# Altium schematic sheet DSUB.schdoc
size 298 x 162 mm
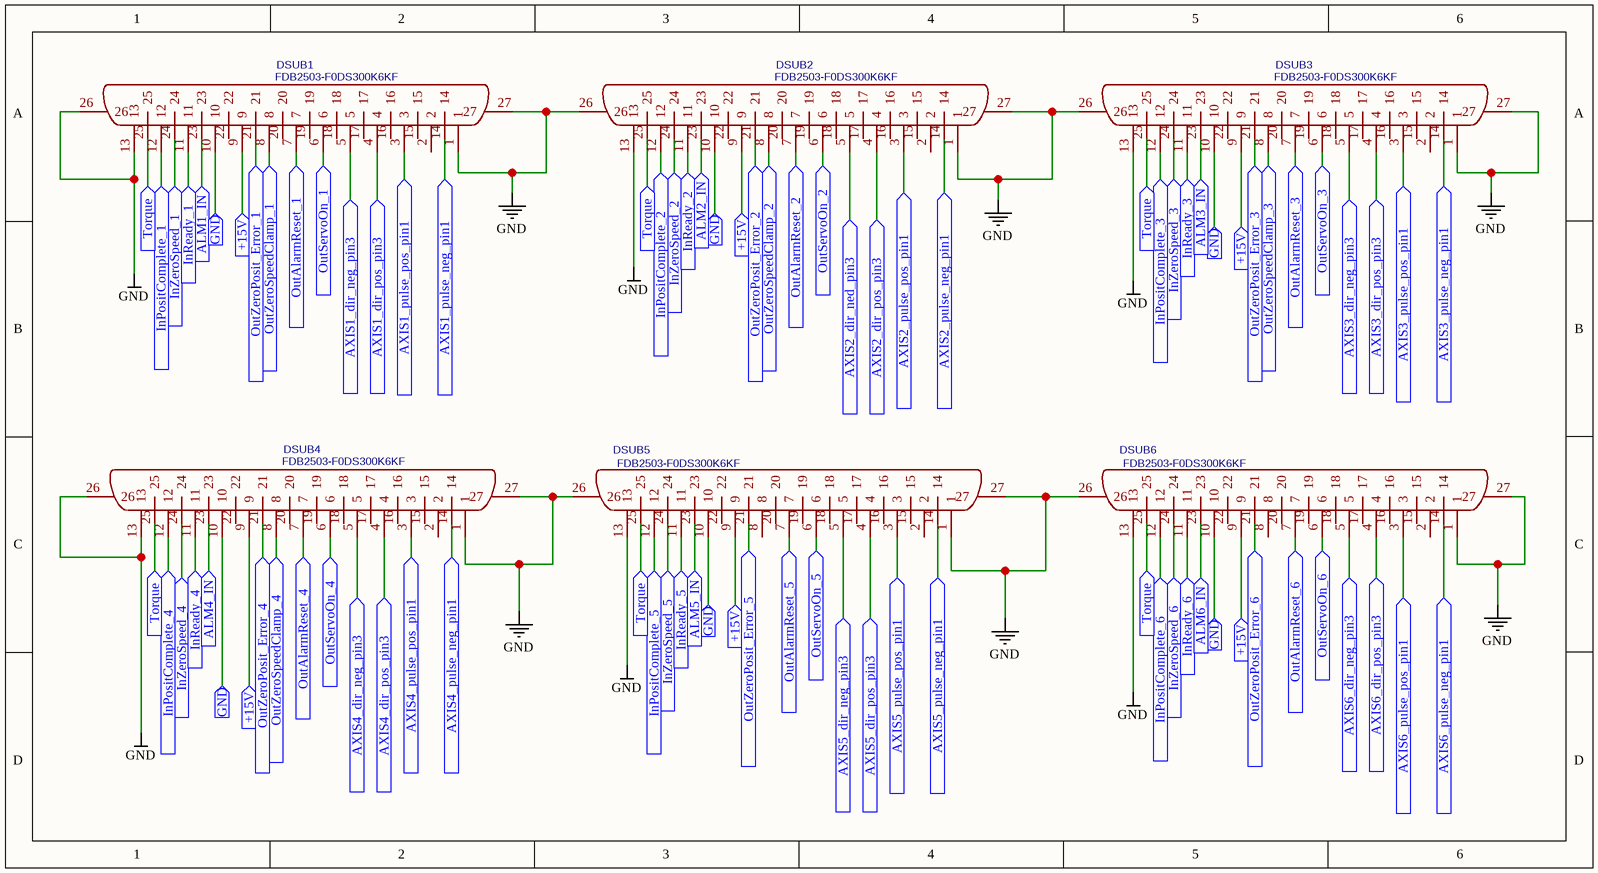
[diagram p0: DSUB.schdoc]

## Parts
DSUB1  FDB2503-F0DS300K6KF  [DB25-TH_FDB2503-F0DS300K6KF]
DSUB2  FDB2503-F0DS300K6KF  [DB25-TH_FDB2503-F0DS300K6KF]
DSUB3  FDB2503-F0DS300K6KF  [DB25-TH_FDB2503-F0DS300K6KF]
DSUB4  FDB2503-F0DS300K6KF  [DB25-TH_FDB2503-F0DS300K6KF]
DSUB5  FDB2503-F0DS300K6KF  [DB25-TH_FDB2503-F0DS300K6KF]
DSUB6  FDB2503-F0DS300K6KF  [DB25-TH_FDB2503-F0DS300K6KF]

## Ports
+15V (in), ALM1_IN (in), ALM2_IN (in), ALM3_IN (in), ALM4_IN (in), ALM5_IN (in), ALM6_IN (in), AXIS1_dir_neg_pin3 (in), AXIS1_dir_pos_pin3 (in), AXIS1_pulse_neg_pin1 (in), AXIS1_pulse_pos_pin1 (in), AXIS2_dir_ned_pin3 (in), AXIS2_dir_pos_pin3 (in), AXIS2_pulse_neg_pin1 (in), AXIS2_pulse_pos_pin1 (in), AXIS3_dir_neg_pin3 (in), AXIS3_dir_pos_pin3 (in), AXIS3_pulse_neg_pin1 (in), AXIS3_pulse_pos_pin1 (in), AXIS4_dir_neg_pin3 (in), AXIS4_dir_pos_pin3 (in), AXIS4_pulse_neg_pin1 (in), AXIS4_pulse_pos_pin1 (in), AXIS5_dir_neg_pin3 (in), AXIS5_dir_pos_pin3 (in), AXIS5_pulse_neg_pin1 (in), AXIS5_pulse_pos_pin1 (in), AXIS6_dir_neg_pin3 (in), AXIS6_dir_pos_pin3 (in), AXIS6_pulse_neg_pin1 (in), AXIS6_pulse_pos_pin1 (in), GND (in), InPositComplete_1 (in), InPositComplete_2 (in), InPositComplete_3 (in), InPositComplete_4 (in), InPositComplete_5 (in), InPositComplete_6 (in), InReady_1 (in), InReady_2 (in), InReady_3 (in), InReady_4 (in), InReady_5 (in), InReady_6 (in), InZeroSpeed_1 (in), InZeroSpeed_2 (in), InZeroSpeed_3 (in), InZeroSpeed_4 (in), InZeroSpeed_5 (in), InZeroSpeed_6 (in), OutAlarmReset_1 (in), OutAlarmReset_2 (in), OutAlarmReset_3 (in), OutAlarmReset_4 (in), OutAlarmReset_5 (in), OutAlarmReset_6 (in), OutServoOn_1 (in), OutServoOn_2 (in), OutServoOn_3 (in), OutServoOn_4 (in), OutServoOn_5 (in), OutServoOn_6 (in), OutZeroPosit_Error_1 (in), OutZeroPosit_Error_2 (in), OutZeroPosit_Error_3 (in), OutZeroPosit_Error_4 (in), OutZeroPosit_Error_5 (in), OutZeroPosit_Error_6 (in), OutZeroSpeedClamp_1 (in), OutZeroSpeedClamp_2 (in), OutZeroSpeedClamp_3 (in), OutZeroSpeedClamp_4 (in), Torque (in)

## Nets
GND: DSUB1.1 DSUB1.13 DSUB1.26 DSUB1.27 DSUB2.1 DSUB2.13 DSUB2.26 DSUB2.27 DSUB3.1 DSUB3.13 DSUB3.26 DSUB3.27 DSUB4.1 DSUB4.13 DSUB4.26 DSUB4.27 DSUB5.1 DSUB5.13 DSUB5.26 DSUB5.27 DSUB6.1 DSUB6.13 DSUB6.26 DSUB6.27
+15V: DSUB1.9 DSUB2.9 DSUB3.9 DSUB4.9 DSUB5.9 DSUB6.9 ; port +15V
ALM1_IN: DSUB1.23 ; port ALM1_IN
ALM2_IN: DSUB2.23 ; port ALM2_IN
ALM3_IN: DSUB3.23 ; port ALM3_IN
ALM4_IN: DSUB4.23 ; port ALM4_IN
ALM5_IN: DSUB5.23 ; port ALM5_IN
ALM6_IN: DSUB6.23 ; port ALM6_IN
AXIS1_dir_neg_pin3: DSUB1.5 ; port AXIS1_dir_neg_pin3
AXIS1_dir_pos_pin3: DSUB1.4 ; port AXIS1_dir_pos_pin3
AXIS1_pulse_neg_pin1: DSUB1.14 ; port AXIS1_pulse_neg_pin1
AXIS1_pulse_pos_pin1: DSUB1.3 ; port AXIS1_pulse_pos_pin1
AXIS2_dir_ned_pin3: DSUB2.5 ; port AXIS2_dir_ned_pin3
AXIS2_dir_pos_pin3: DSUB2.4 ; port AXIS2_dir_pos_pin3
AXIS2_pulse_neg_pin1: DSUB2.14 ; port AXIS2_pulse_neg_pin1
AXIS2_pulse_pos_pin1: DSUB2.3 ; port AXIS2_pulse_pos_pin1
AXIS3_dir_neg_pin3: DSUB3.5 ; port AXIS3_dir_neg_pin3
AXIS3_dir_pos_pin3: DSUB3.4 ; port AXIS3_dir_pos_pin3
AXIS3_pulse_neg_pin1: DSUB3.14 ; port AXIS3_pulse_neg_pin1
AXIS3_pulse_pos_pin1: DSUB3.3 ; port AXIS3_pulse_pos_pin1
AXIS4_dir_neg_pin3: DSUB4.5 ; port AXIS4_dir_neg_pin3
AXIS4_dir_pos_pin3: DSUB4.4 ; port AXIS4_dir_pos_pin3
AXIS4_pulse_neg_pin1: DSUB4.14 ; port AXIS4_pulse_neg_pin1
AXIS4_pulse_pos_pin1: DSUB4.3 ; port AXIS4_pulse_pos_pin1
AXIS5_dir_neg_pin3: DSUB5.5 ; port AXIS5_dir_neg_pin3
AXIS5_dir_pos_pin3: DSUB5.4 ; port AXIS5_dir_pos_pin3
AXIS5_pulse_neg_pin1: DSUB5.14 ; port AXIS5_pulse_neg_pin1
AXIS5_pulse_pos_pin1: DSUB5.3 ; port AXIS5_pulse_pos_pin1
AXIS6_dir_neg_pin3: DSUB6.5 ; port AXIS6_dir_neg_pin3
AXIS6_dir_pos_pin3: DSUB6.4 ; port AXIS6_dir_pos_pin3
AXIS6_pulse_neg_pin1: DSUB6.14 ; port AXIS6_pulse_neg_pin1
AXIS6_pulse_pos_pin1: DSUB6.3 ; port AXIS6_pulse_pos_pin1
GND: DSUB1.10 DSUB2.10 DSUB3.10 DSUB4.10 DSUB5.10 DSUB6.10 ; port GND  [a separate net that carries the same name]
InPositComplete_1: DSUB1.12 ; port InPositComplete_1
InPositComplete_2: DSUB2.12 ; port InPositComplete_2
InPositComplete_3: DSUB3.12 ; port InPositComplete_3
InPositComplete_4: DSUB4.12 ; port InPositComplete_4
InPositComplete_5: DSUB5.12 ; port InPositComplete_5
InPositComplete_6: DSUB6.12 ; port InPositComplete_6
InReady_1: DSUB1.11 ; port InReady_1
InReady_2: DSUB2.11 ; port InReady_2
InReady_3: DSUB3.11 ; port InReady_3
InReady_4: DSUB4.11 ; port InReady_4
InReady_5: DSUB5.11 ; port InReady_5
InReady_6: DSUB6.11 ; port InReady_6
InZeroSpeed_1: DSUB1.24 ; port InZeroSpeed_1
InZeroSpeed_2: DSUB2.24 ; port InZeroSpeed_2
InZeroSpeed_3: DSUB3.24 ; port InZeroSpeed_3
InZeroSpeed_4: DSUB4.24 ; port InZeroSpeed_4
InZeroSpeed_5: DSUB5.24 ; port InZeroSpeed_5
InZeroSpeed_6: DSUB6.24 ; port InZeroSpeed_6
OutAlarmReset_1: DSUB1.7 ; port OutAlarmReset_1
OutAlarmReset_2: DSUB2.7 ; port OutAlarmReset_2
OutAlarmReset_3: DSUB3.7 ; port OutAlarmReset_3
OutAlarmReset_4: DSUB4.7 ; port OutAlarmReset_4
OutAlarmReset_5: DSUB5.7 ; port OutAlarmReset_5
OutAlarmReset_6: DSUB6.7 ; port OutAlarmReset_6
OutServoOn_1: DSUB1.6 ; port OutServoOn_1
OutServoOn_2: DSUB2.6 ; port OutServoOn_2
OutServoOn_3: DSUB3.6 ; port OutServoOn_3
OutServoOn_4: DSUB4.6 ; port OutServoOn_4
OutServoOn_5: DSUB5.6 ; port OutServoOn_5
OutServoOn_6: DSUB6.6 ; port OutServoOn_6
OutZeroPosit_Error_1: DSUB1.21 ; port OutZeroPosit_Error_1
OutZeroPosit_Error_2: DSUB2.21 ; port OutZeroPosit_Error_2
OutZeroPosit_Error_3: DSUB3.21 ; port OutZeroPosit_Error_3
OutZeroPosit_Error_4: DSUB4.21 ; port OutZeroPosit_Error_4
OutZeroPosit_Error_5: DSUB5.21 ; port OutZeroPosit_Error_5
OutZeroPosit_Error_6: DSUB6.21 ; port OutZeroPosit_Error_6
OutZeroSpeedClamp_1: DSUB1.8 ; port OutZeroSpeedClamp_1
OutZeroSpeedClamp_2: DSUB2.8 ; port OutZeroSpeedClamp_2
OutZeroSpeedClamp_3: DSUB3.8 ; port OutZeroSpeedClamp_3
OutZeroSpeedClamp_4: DSUB4.8 ; port OutZeroSpeedClamp_4
Torque: DSUB1.25 DSUB2.25 DSUB3.25 DSUB4.25 DSUB5.25 DSUB6.25 ; port Torque

Not connected (* = marked no-connect by the designer): DSUB1 2 15 16 17 18 19 20 22; DSUB2 2 15 16 17 18 19 20 22; DSUB3 2 15 16 17 18 19 20 22; DSUB4 2 15 16 17 18 19 20 22; DSUB5 2 8 15 16 17 18 19 20 22; DSUB6 2 8 15 16 17 18 19 20 22

## Library data of the parts
DSUB1-DSUB6 = FDB2503-F0DS300K6KF: Manufacturer: TXGA(特思嘉); Contributor: LCSC; Supplier: LCSC; Supplier Part: C2834383; Manufacturer Part: FDB2503-F0DS300K6KF; JLCPCB Part Class: Extended Part; link: https://lcsc.com/eda_search?q=C2834383&%26type=1&ref=editor; spicePre: D; spiceSymbolName: FDB2503-F0DS300K6KF